# Altium project HW_ADHERENT_SYSCTRL_R1.PrjPcb (part 2 of 2)

## Sheet 05_MCU.SchDoc: HW_ADHERENT_SYSCTRL_R1
size A3; Organization: ASISGUARD; Address1: Kemalpasa, Kemalpasa Cd. No:290 D:292H, 35060 Bornova/Izmir/Turkey; SheetNumber: 8; SheetTotal: 14
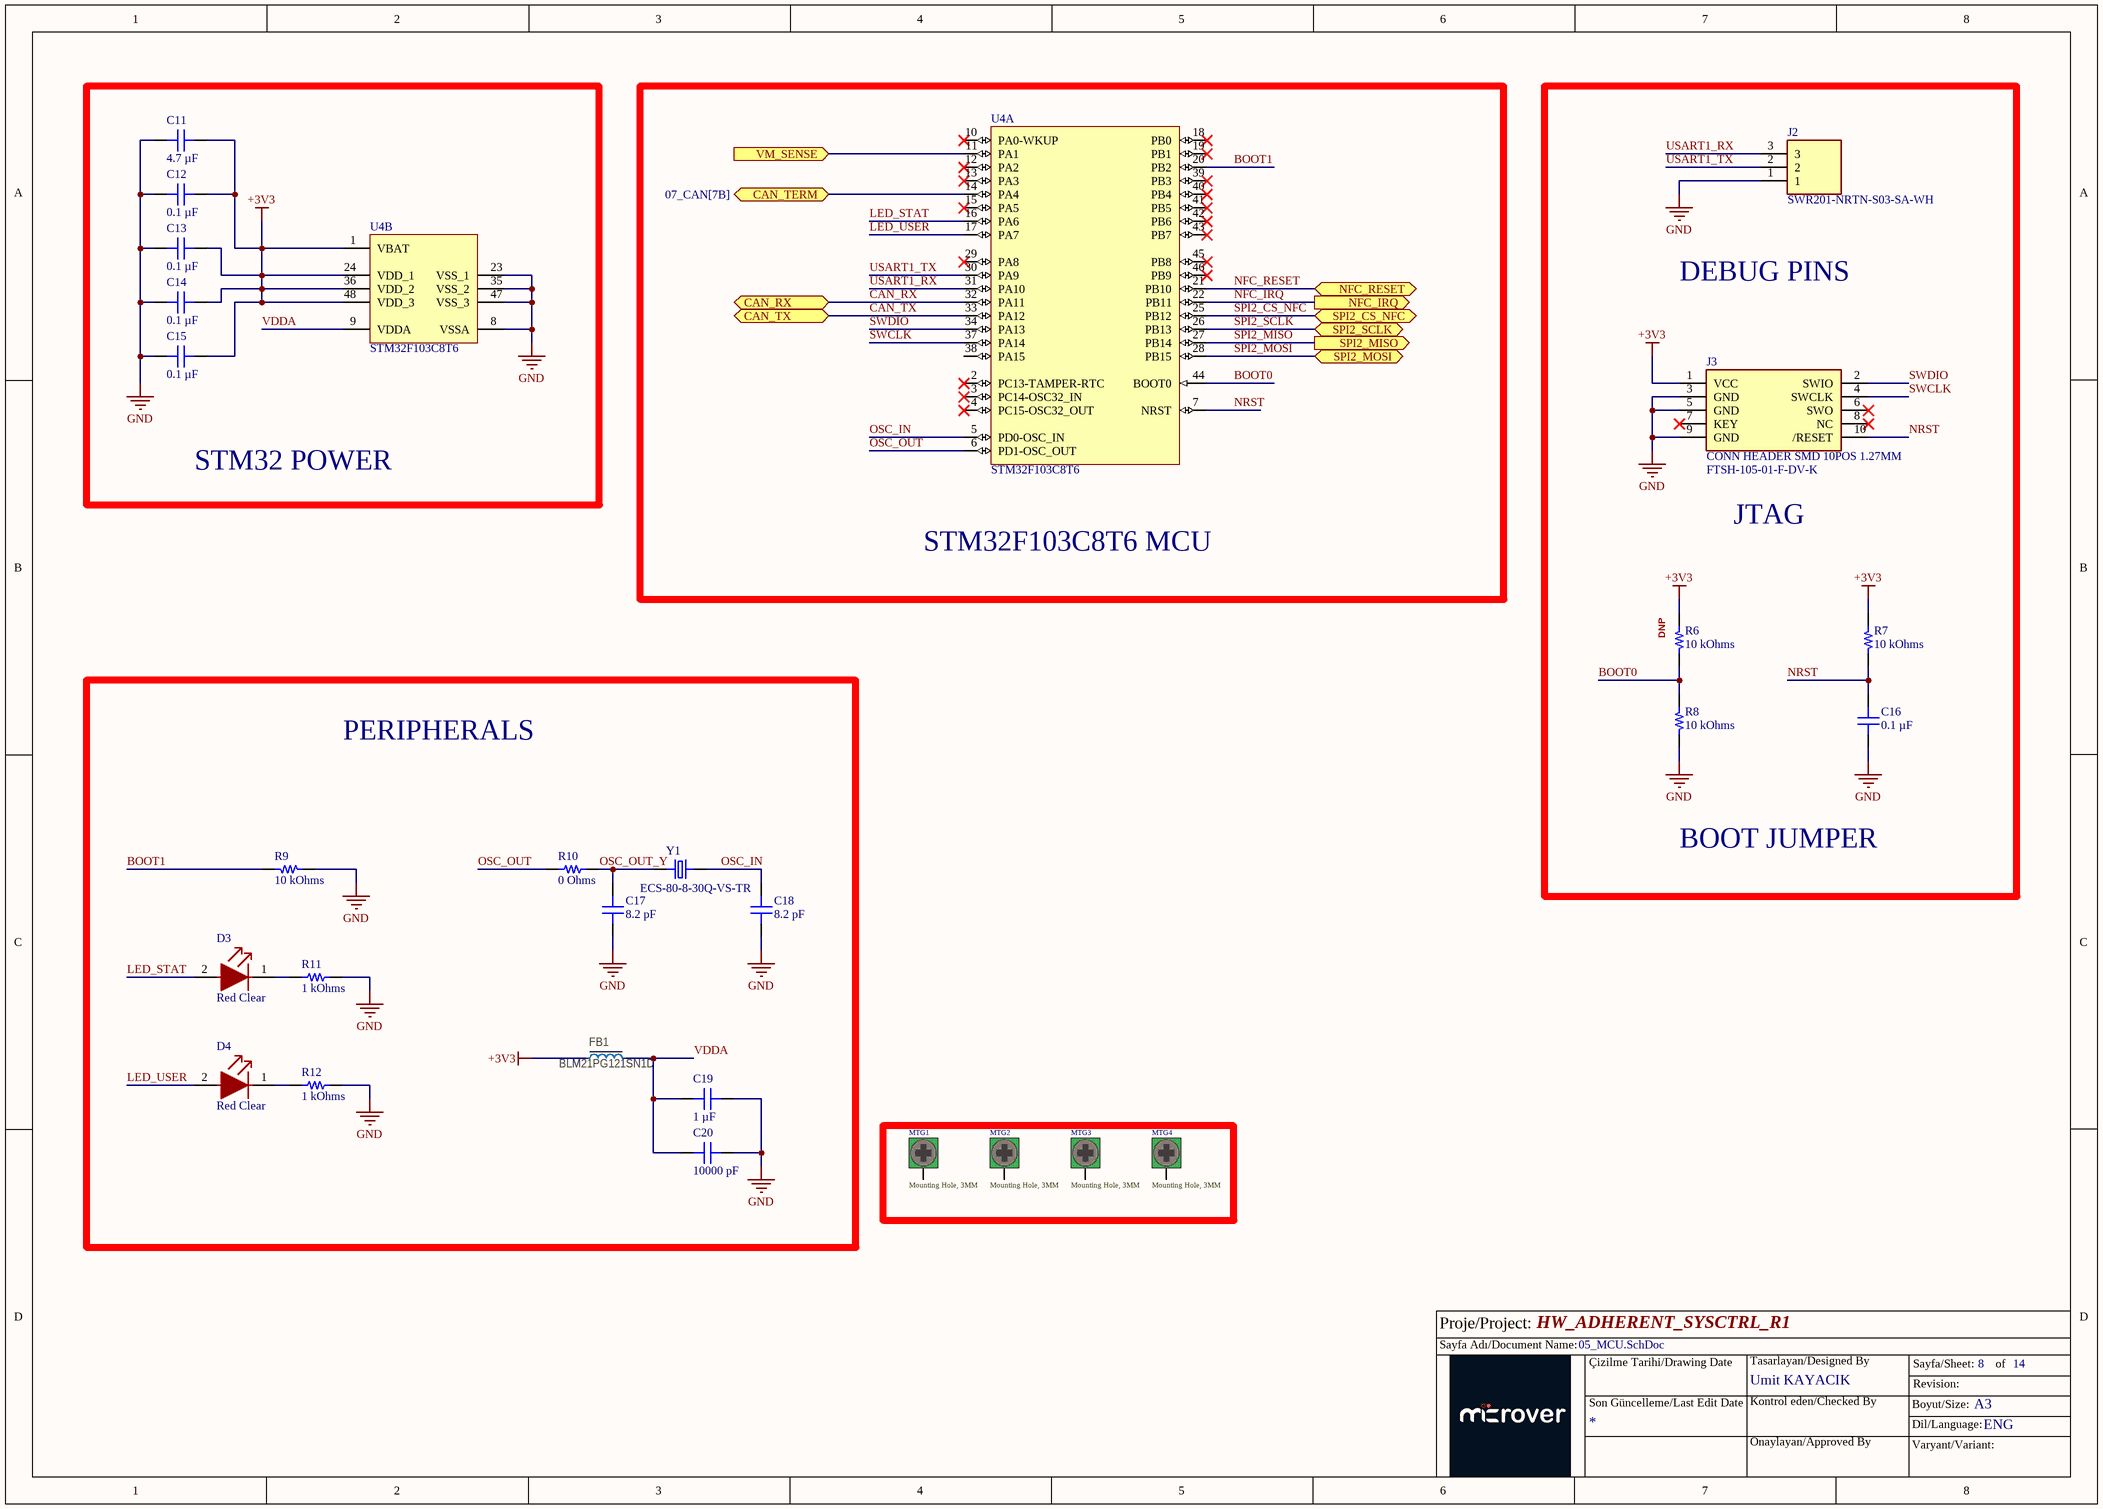
[diagram p5: 05_MCU.SchDoc]

### Parts
C11  4.7 µF  [CAP 0805_2012]
C12  Capacitance: 0.1 µF  [CAP 0603_1608]  (hidden comment: GCM188R71H104KA57J)
C13  Capacitance: 0.1 µF  [CAP 0603_1608]  (hidden comment: GCM188R71H104KA57J)
C14  Capacitance: 0.1 µF  [CAP 0603_1608]  (hidden comment: GCM188R71H104KA57J)
C15  Capacitance: 0.1 µF  [CAP 0603_1608]  (hidden comment: GCM188R71H104KA57J)
C16  Capacitance: 0.1 µF  [CAP 0603_1608]  (hidden comment: GCM188R71H104KA57J)
C17  8.2 pF  [CAP 0402_1005]
C18  8.2 pF  [CAP 0402_1005]
C19  1 µF  [CAP 0603_1608]
C20  10000 pF  [CAP 0603_1608]
D3  Color: Red Clear  [Lite-On_RED_0603]  (hidden comment: LED RED CLEAR SMD)
D4  Color: Red Clear  [Lite-On_RED_0603]  (hidden comment: LED RED CLEAR SMD)
FB1  BLM21PG121SN1D  [INDC2012X11L]
J2  SWR201-NRTN-S03-SA-WH  [SHDR3W50P0X200_1X3_790X460X630P]
J3  CONN HEADER SMD 10POS 1.27MM  [Samtec_0_MFG]
MTG1  Mounting Hole, 3MM  [MTG-PTH-3MM]  (no BOM)
MTG2  Mounting Hole, 3MM  [MTG-PTH-3MM]  (no BOM)
MTG3  Mounting Hole, 3MM  [MTG-PTH-3MM]  (no BOM)
MTG4  Mounting Hole, 3MM  [MTG-PTH-3MM]  (no BOM)
R6  10 kOhms  [RES 0402_1005]
R7  10 kOhms  [RES 0402_1005]
R8  10 kOhms  [RES 0402_1005]
R9  10 kOhms  [RES 0402_1005]
R10  0 Ohms  [RES 0402_1005]
R11  1 kOhms  [RES 0402_1005]
R12  1 kOhms  [RES 0402_1005]
U4  STM32F103C8T6  [LQFP48_STM]  (parts A,B of 2)
Y1  ECS-80-8-30Q-VS-TR  [XTAL_ECS-80-8-30Q-VS-TR]

### Blocks framed on the sheet
STM32 POWER: C11-C15 U4
STM32F103C8T6 MCU: U4
PERIPHERALS: C17-C20 D3 D4 FB1 R9-R12 Y1

### Ports
CAN_RX (bidir, see 07_CAN[2B]), CAN_TERM (bidir, see 07_CAN[7B]), CAN_TX (bidir, see 07_CAN[2B]), NFC_IRQ (out), NFC_RESET (bidir), SPI2_CS_NFC (bidir), SPI2_MISO (out), SPI2_MOSI (bidir), SPI2_SCLK (bidir), VM_SENSE (in)

### Nets
+3V3: C11.2 C12.1 C13.1 C14.1 C15.1 FB1.1 J3.1(VCC) R6.1 R7.1 U4.1(VBAT) U4.24(VDD_1) U4.36(VDD_2) U4.48(VDD_3)
GND: C11.1 C12.2 C13.2 C14.2 C15.2 C16.2 C17.1 C18.1 C19.2 C20.2 J2.1 J3.3(GND) J3.5(GND) J3.9(GND) R8.2 R9.1 R11.2 R12.2 U4.8(VSSA) U4.23(VSS_1) U4.35(VSS_2) U4.47(VSS_3)
BOOT0: R6.2 R8.1 U4.44(BOOT0)
BOOT1: R9.2 U4.20(PB2)
CAN_RX: U4.32(PA11) ; port CAN_RX
CAN_TX: U4.33(PA12) ; port CAN_TX
LED_STAT: D3.2(A) U4.16(PA6)
LED_USER: D4.2(A) U4.17(PA7)
NFC_IRQ: U4.22(PB11) ; port NFC_IRQ
NFC_RESET: U4.21(PB10) ; port NFC_RESET
NRST: C16.1 J3.10(/RESET) R7.2 U4.7(NRST)
OSC_IN: C18.2 U4.5(PD0-OSC_IN) Y1.2(OUT/IN)
OSC_OUT: R10.1 U4.6(PD1-OSC_OUT)
OSC_OUT_Y: C17.2 R10.2 Y1.1(IN/OUT)
SPI2_CS_NFC: U4.25(PB12) ; port SPI2_CS_NFC
SPI2_MISO: U4.27(PB14) ; port SPI2_MISO
SPI2_MOSI: U4.28(PB15) ; port SPI2_MOSI
SPI2_SCLK: U4.26(PB13) ; port SPI2_SCLK
SWCLK: J3.4(SWCLK) U4.37(PA14)
SWDIO: J3.2(SWIO) U4.34(PA13)
USART1_RX: J2.3 U4.31(PA10)
USART1_TX: J2.2 U4.30(PA9)
VDDA: C19.1 C20.1 FB1.2 U4.9(VDDA)
NetD3_1: D3.1(C) R11.1
NetD4_1: D4.1(C) R12.1
NetU4_11: U4.11(PA1) ; port VM_SENSE
NetU4_14: U4.14(PA4) ; port CAN_TERM

Not connected (* = marked no-connect by the designer): J3 6(SWO)* 7(KEY)* 8(NC)*; MTG1 0; MTG2 0; MTG3 0; MTG4 0; U4 2(PC13-TAMPER-RTC)* 3(PC14-OSC32_IN)* 4(PC15-OSC32_OUT)* 10(PA0-WKUP)* 12(PA2)* 13(PA3)* 15(PA5)* 18(PB0)* 19(PB1)* 29(PA8)* 38(PA15) 39(PB3)* 40(PB4)* 41(PB5)* 42(PB6)* 43(PB7)* 45(PB8)* 46(PB9)*

### Notes on the sheet
- DEBUG PINS
- JTAG
- (near R6) DNP
- BOOT JUMPER
- Proje/Project:
- Sayfa Adı/Document Name:
- Çizilme Tarihi/Drawing Date
- Umit KAYACIK
- Tasarlayan/Designed By
- Sayfa/Sheet:
- Revision:
- of
- Son Güncelleme/Last Edit Date
- Kontrol eden/Checked By
- Onaylayan/Approved By
- Boyut/Size:
- Varyant/Variant:
- Dil/Language:
- A3
- ENG

### Library data of the parts
C11 = GRM21BZ71H475KE15K: CAP CER 4.7UF 50V X7R 0805; manufacturer: Murata Electronics; Tolerance: ±10%; Part Number: GRM21BZ71H475KE15K; Capacitance: 4.7 µF; Applications: General Purpose; componentlink1description: Datasheet; componentlink1url: https://search.murata.co.jp/Ceramy/image/img/A01X/G101/ENG/GRM21BZ71H475KE15-01.pdf; componentlink2description: DigiKey Link; componentlink2url: https://www.digikey.com/en/products/detail/murata-electronics/GRM21BZ71H475KE15K/13904908; Device Package: 0805 (2012 Metric); lastupdated: 6.04.2026 19:31:51; Lifecycle Status: Active; Minimum Order: 1; Mounting Type: Surface Mount, MLCC; Operating Temperature: -55°C ~ 125°C; Package / Case: 0805 (2012 Metric); packaging: TapeAndReel; partid: 39591; Part Status: Active; price: 0.17; series: GRM; Size / Dimension: 0.079" L x 0.049" W (2.00mm x 1.25mm); Supplier 1: DigiKey; Supplier Part Number 1: 490-GRM21BZ71H475KE15KCT-ND; Temperature Coefficient: X7R; Thickness (Max): 0.057" (1.45mm); value: 4.7 µF; Voltage - Rated: 50V
C12-C16 = GCM188R71H104KA57J: CAP CER 0.1UF 50V X7R 0603; manufacturer: Murata Electronics; Tolerance: ±10%; Part Number: GCM188R71H104KA57J; Applications: Automotive; componentlink1description: Datasheet; componentlink1url: https://psearch.en.murata.com/capacitor/product/GCM188R71H104KA57%23.pdf; componentlink2description: DigiKey Link; componentlink2url: https://www.digikey.com/en/products/detail/murata-electronics/GCM188R71H104KA57J/2591942; Device Package: 0603 (1608 Metric); lastupdated: 6.04.2026 19:22:36; Lifecycle Status: Active; Minimum Order: 1; Mounting Type: Surface Mount, MLCC; Operating Temperature: -55°C ~ 125°C; Package / Case: 0603 (1608 Metric); packaging: TapeAndReel; partid: 60442; Part Status: Not For New Designs; price: 0.03; Ratings: AEC-Q200; series: GCM; Size / Dimension: 0.063" L x 0.031" W (1.60mm x 0.80mm); Supplier 1: DigiKey; Supplier Part Number 1: 490-8020-1-ND; Temperature Coefficient: X7R; Thickness (Max): 0.035" (0.90mm); Voltage - Rated: 50V
C17 C18 = GMC04CG8R2J25NT: CAP0402 COG 8.2PF 5% 25V; manufacturer: Cal-Chip Electronics, Inc.; Temperature Coefficient: C0G, NP0; Part Number: GMC04CG8R2J25NT; Capacitance: 8.2 pF; Applications: General Purpose; componentlink1description: Datasheet; componentlink1url: https://calchip.com/wp-content/uploads/2025/05/GMC-Series-3.pdf; componentlink2description: DigiKey Link; componentlink2url: https://www.digikey.com/en/products/detail/cal-chip-electronics-inc/GMC04CG8R2J25NT/27784357; Device Package: 0402 (1005 Metric); Features: General Purpose; lastupdated: 6.04.2026 19:06:51; Lifecycle Status: Active; Minimum Order: 1; Mounting Type: Surface Mount, MLCC; Operating Temperature: -55°C ~ 125°C; Package / Case: 0402 (1005 Metric); packaging: TapeAndReel; partid: 61382; price: 0.07; series: GMC; Size / Dimension: 0.039" L x 0.020" W (1.00mm x 0.50mm); Supplier 1: DigiKey; Supplier Part Number 1: 4713-GMC04CG8R2J25NTCT-ND; Thickness (Max): 0.022" (0.55mm); Tolerance: ±5%; value: 8.2 pF; Voltage - Rated: 25V
C19 = GMC10X7R105K25NT: CAP0603 X7R 1UF 10% 25V; manufacturer: Cal-Chip Electronics, Inc.; Part Number: GMC10X7R105K25NT; Capacitance: 1 µF; Applications: General Purpose; componentlink1description: Datasheet; componentlink1url: https://calchip.com/wp-content/uploads/2023/05/gmc_series.pdf; componentlink2description: DigiKey Link; componentlink2url: https://www.digikey.com/en/products/detail/cal-chip-electronics-inc/GMC10X7R105K25NT/22461338; Device Package: 0603 (1608 Metric); lastupdated: 6.04.2026 19:18:33; Lifecycle Status: Active; Minimum Order: 1; Mounting Type: Surface Mount, MLCC; Operating Temperature: -55°C ~ 125°C; Package / Case: 0603 (1608 Metric); packaging: TapeAndReel; partid: 68086; price: 0.01; series: GMC; Size / Dimension: 0.063" L x 0.031" W (1.60mm x 0.80mm); Supplier 1: DigiKey; Supplier Part Number 1: 4713-GMC10X7R105K25NTCT-ND; Temperature Coefficient: X7R; Thickness (Max): 0.037" (0.95mm); Tolerance: ±10%; value: 1 µF; Voltage - Rated: 25V
C20 = C0603C103K4RECTU: CAP CER 0603 10NF 16V X7R 10%; manufacturer: KEMET; Part Number: C0603C103K4RECTU; Capacitance: 10000 pF; Applications: ESD Protection; componentlink1description: Datasheet; componentlink1url: https://search.kemet.com/download/datasheet/C0603C103K4REC7867; componentlink2description: DigiKey Link; componentlink2url: https://www.digikey.com/en/products/detail/kemet/C0603C103K4RECTU/8643658; Device Package: 0603 (1608 Metric); lastupdated: 6.04.2026 19:17:55; Lifecycle Status: Active; Minimum Order: 1; Mounting Type: Surface Mount, MLCC; Operating Temperature: -55°C ~ 125°C; Package / Case: 0603 (1608 Metric); packaging: TapeAndReel; partid: 66152; price: 0.01; series: ESD SMD Comm X7R; Size / Dimension: 0.063" L x 0.031" W (1.60mm x 0.80mm); Supplier 1: DigiKey; Supplier Part Number 1: 399-C0603C103K4RECTUCT-ND; Temperature Coefficient: X7R; Thickness (Max): 0.034" (0.87mm); Tolerance: ±10%; value: 10000 pF; Voltage - Rated: 16V
D3 D4 = LTST-C191KRKT_2: Red 631nm LED Indication - Discrete 2V 0603 (1608 Metric); Manufacturer: Lite-On Inc.; Order Code: DIGI: 160-1447-2-ND; Manufacturer Part Number: LTST-C191KRKT
FB1 = FB0402-120R@100M-500mA: Ferrite Bead, 120 Ohm @ 100MHz, 500mA, 250 mOhm Max; Manufacturer: Murata; Manufacturer Part Number: BLM15AG121SN1D; Part number IPS: 00000009954; Part number Norautron: 265230631; Part number NEMS: 100300099; Value: 120R/0.55A; Note: Chip EMIFIL Inductor Type Chip Ferrite Bead; Artikkelnr Noca: 33029317; Pad Count: 2; Component Status: Active; Part Number: FB0402-120R@100M-500mA; Footprint Doc: 0402; LatestRevisionDate: 2014-01-10; Published: 2011-11-14; ComponentLink1Description: Datasheet; ComponentLink2Description: Supplier link; ComponentLink1URL: N.A.; ComponentLink2URL: N.A.; HelpURL: http://search.murata.co.jp/Ceramy/image/img/PDF/ENG/L0110S0100BLM15A_SN.pdf; Supplier 1: Digi-Key; Supplier Part Number 1: 490-1005-1-ND; Supplier 2: Farnell; Supplier Part Number 2: 151-5760; Component Class: Inductors; PartId: 100300099; Author: rsk
J2 = SWR201-NRTN-S03-SA-WH: Connector; Manufacturer_Name: Sullins; Datasheet Link: https://drawings-pdf.s3.amazonaws.com/11623.pdf; Height: 6.3mm; Manufacturer_Part_Number: SWR201-NRTN-S03-SA-WH
J3 = FTSH-105-01-F-DV-K: Connector Header Surface Mount 10 position 0.050" (1.27mm); Order Code: DIGI: SAM8796-ND; Manufacturer Part Number: FTSH-105-01-F-DV-K
MTG1-MTG4 = MTG3MM
R6-R9 = RMCF0402FT10K0: RES 10K OHM 1% 1/16W 0402; Manufacturer: Stackpole Electronics Inc; Power (Watts): 0.063W, 1/16W; Temperature Coefficient: ±100ppm/°C; Part Number: RMCF0402FT10K0; Value: 10 kOhms; ComponentLink1Description: Datasheet; ComponentLink1URL: https://www.seielect.com/catalog/sei-rmcf_rmcp.pdf; ComponentLink2Description: DigiKey Link; ComponentLink2URL: https://www.digikey.com/en/products/detail/stackpole-electronics-inc/RMCF0402FT10K0/1761433; Composition: Thick Film; Device Package: 0402 (1005 Metric); Features: Automotive AEC-Q200; Height - Seated (Max): 0.016" (0.40mm); LastUpdated: 9.02.2024 20:29:20; Lifecycle Status: Active; Minimum Order: 1; Number of Terminations: 2; Operating Temperature: -55°C ~ 155°C; Package / Case: 0402 (1005 Metric); Packaging: CutTape; PartId: 20541; Part Status: Active; Price: 0.01; Ratings: AEC-Q200; Resistance: 10 kOhms; Series: RMCF; Size / Dimension: 0.039" L x 0.020" W (1.00mm x 0.50mm); Supplier 1: DigiKey; Supplier Part Number 1: RMCF0402FT10K0CT-ND; Supplier Device Package: 0402; Tolerance: ±1%
R10 = RMCF0402ZT0R00: RES 0 OHM JUMPER 1/16W 0402; Manufacturer: Stackpole Electronics Inc; Power (Watts): 0.063W, 1/16W; Part Number: RMCF0402ZT0R00; Value: 0 Ohms; ComponentLink1Description: Datasheet; ComponentLink1URL: https://www.seielect.com/catalog/sei-rmcf_rmcp.pdf; ComponentLink2Description: DigiKey Link; ComponentLink2URL: https://www.digikey.com/en/products/detail/stackpole-electronics-inc/RMCF0402ZT0R00/1756905; Composition: Thick Film; Device Package: 0402 (1005 Metric); Features: Automotive AEC-Q200; Height - Seated (Max): 0.016" (0.40mm); LastUpdated: 9.02.2024 20:29:34; Lifecycle Status: Active; Minimum Order: 1; Number of Terminations: 2; Operating Temperature: -55°C ~ 155°C; Package / Case: 0402 (1005 Metric); Packaging: CutTape; PartId: 17627; Part Status: Active; Price: 0.01; Ratings: AEC-Q200; Resistance: 0 Ohms; Series: RMCF; Size / Dimension: 0.039" L x 0.020" W (1.00mm x 0.50mm); Supplier 1: DigiKey; Supplier Part Number 1: RMCF0402ZT0R00CT-ND; Supplier Device Package: 0402; Tolerance: Jumper
R11 R12 = RMCF0402FT1K00: RES 1K OHM 1% 1/16W 0402; Manufacturer: Stackpole Electronics Inc; Power (Watts): 0.063W, 1/16W; Temperature Coefficient: ±100ppm/°C; Part Number: RMCF0402FT1K00; Value: 1 kOhms; ComponentLink1Description: Datasheet; ComponentLink1URL: https://www.seielect.com/catalog/sei-rmcf_rmcp.pdf; ComponentLink2Description: DigiKey Link; ComponentLink2URL: https://www.digikey.com/en/products/detail/stackpole-electronics-inc/RMCF0402FT1K00/1761754; Composition: Thick Film; Device Package: 0402 (1005 Metric); Features: Automotive AEC-Q200; Height - Seated (Max): 0.016" (0.40mm); LastUpdated: 9.02.2024 20:29:20; Lifecycle Status: Active; Minimum Order: 1; Number of Terminations: 2; Operating Temperature: -55°C ~ 155°C; Package / Case: 0402 (1005 Metric); Packaging: CutTape; PartId: 20544; Part Status: Active; Price: 0.01; Ratings: AEC-Q200; Resistance: 1 kOhms; Series: RMCF; Size / Dimension: 0.039" L x 0.020" W (1.00mm x 0.50mm); Supplier 1: DigiKey; Supplier Part Number 1: RMCF0402FT1K00CT-ND; Supplier Device Package: 0402; Tolerance: ±1%
U4 = STM32F103C8T6: ARM Cortex-M3 32-bit MCU, 64 KB Flash, 20 KB Internal RAM, 37 I/Os, 48-pin LQFP, -40 to 85 degC, Tray; Operating Frequency(F) (Processor speed) (MHz): 72; Supply Voltage(Vcc) min (V): 2; FLASH Size (Prog) (kB): 64; Internal RAM Size (kB): 20; I/Os (High Current): 37; A/D Converter: 2x12-bit (10 Channel); Core: ARM Cortex-M3; ComponentLink2Description: Datasheet; ComponentLink3Description: Package Specification; Mounting Technology: Surface Mount; ComponentLink3URL: http://www.st.com/st-web-ui/static/active/en/resource/technical/document/datasheet/DM00058181.pdf; DatasheetVersion: Rev. 16; ComponentLink1URL: http://www.st.com/web/en/home.html; ComponentLink1Description: Manufacturer URL; Manufacturer Part Number: STM32F103C8T6; Packing: Tray; PackageVersion: Rev. 6, 06/2013; PackageReference: LQFP48; PackageDescription: 48-Pin Low Profile Quad Flat Package, 7 x 7 mm Body, 0.5 mm Pitch; ComponentLink2URL: http://www.st.com/st-web-ui/static/active/en/resource/technical/document/datasheet/CD00161566.pdf; LCSC Part Number: C8734; LCSC Manufacturer Part Number: STM32F103C8T6
Y1 = ECS-80-8-30Q-VS-TR: 8 MHz Â±30ppm Crystal 8pF 100 Ohms 2-SMD, No Lead; MF: ECS Inc.; SnapEDA_Link: https://www.snapeda.com/parts/ECS-80-8-30Q-VS-TR/ECS/view-part/?ref=snap; Package: SMD-2 ECS Inc.; Value: *; MP: ECS-80-8-30Q-VS-TR; Check_prices: https://www.snapeda.com/parts/ECS-80-8-30Q-VS-TR/ECS/view-part/?ref=eda

## Sheet 06_DRIVER.SchDoc: HW_ADHERENT_SYSCTRL_R1
size A3; Organization: ASISGUARD; Address1: Kemalpasa, Kemalpasa Cd. No:290 D:292H, 35060 Bornova/Izmir/Turkey; SheetNumber: 9; SheetTotal: 14
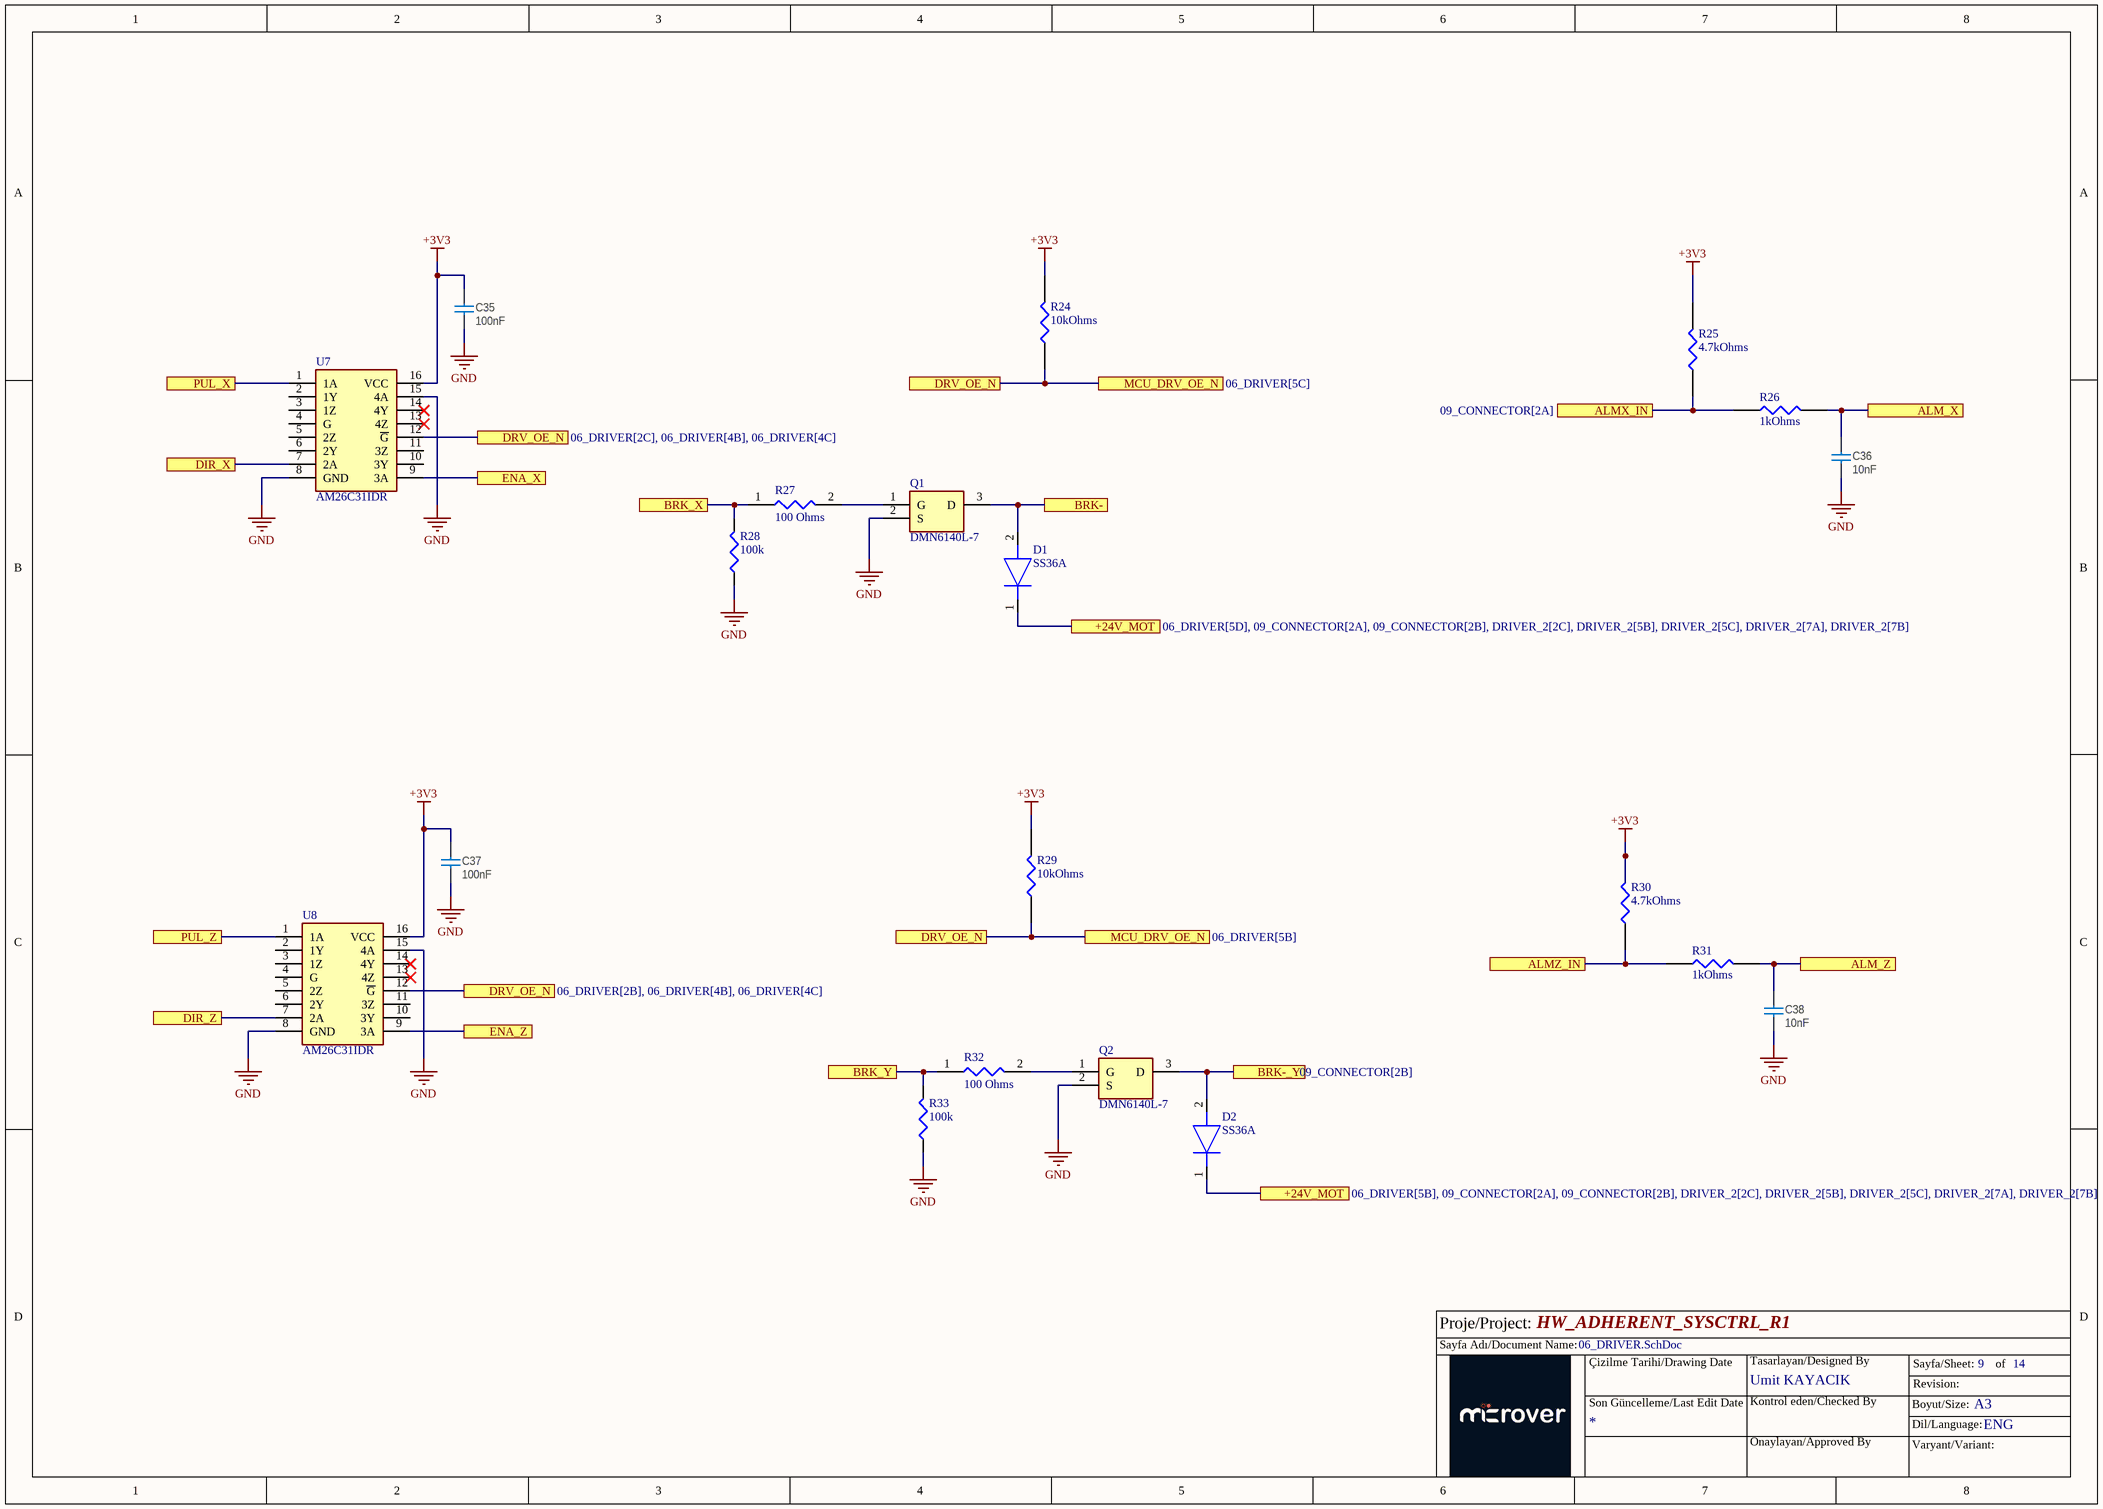
[diagram p6: 06_DRIVER.SchDoc]

### Parts
C35  100nF  [CAPC0603X03L_C]
C36  10nF  [CAPC0603X03L_C]
C37  100nF  [CAPC0603X03L_C]
C38  10nF  [CAPC0603X03L_C]
D1  SS36A  [DIOM5026X262N]
D2  SS36A  [DIOM5026X262N]
Q1  DMN6140L-7  [SOT96P240X110-3N]
Q2  DMN6140L-7  [SOT96P240X110-3N]
R24  10kOhms  [RESC0603X03L_C]
R25  4.7kOhms  [RES_0402]
R26  1kOhms  [RESC0603X03L_C]
R27  100 Ohms  [RESC1608X55N]
R28  value 100k  [SMR0603]  (hidden comment: RES 180K OHM 1% 1/10W 0603)
R29  10kOhms  [RESC0603X03L_C]
R30  4.7kOhms  [RES_0402]
R31  1kOhms  [RESC0603X03L_C]
R32  100 Ohms  [RESC1608X55N]
R33  value 100k  [SMR0603]  (hidden comment: RES 180K OHM 1% 1/10W 0603)
U7  AM26C31IDR  [SOIC127P600X175-16N]
U8  AM26C31IDR  [SOIC127P600X175-16N]

### Ports
+24V_MOT (see 06_DRIVER[5B], 09_CONNECTOR[2A], 09_CONNECTOR[2B], DRIVER_2[2C], DRIVER_2[5B], DRIVER_2[5C], DRIVER_2[7A], DRIVER_2[7B]), +24V_MOT (see 06_DRIVER[5D], 09_CONNECTOR[2A], 09_CONNECTOR[2B], DRIVER_2[2C], DRIVER_2[5B], DRIVER_2[5C], DRIVER_2[7A], DRIVER_2[7B]), ALM_X, ALM_Z, ALMX_IN (see 09_CONNECTOR[2A]), ALMZ_IN, BRK-, BRK-_Y (see 09_CONNECTOR[2B]), BRK_X, BRK_Y, DIR_X, DIR_Z, DRV_OE_N (see 06_DRIVER[2B], 06_DRIVER[2C], 06_DRIVER[4B]), DRV_OE_N (see 06_DRIVER[2B], 06_DRIVER[2C], 06_DRIVER[4C]), DRV_OE_N (see 06_DRIVER[2B], 06_DRIVER[4B], 06_DRIVER[4C]), DRV_OE_N (see 06_DRIVER[2C], 06_DRIVER[4B], 06_DRIVER[4C]), ENA_X, ENA_Z, MCU_DRV_OE_N (see 06_DRIVER[5B]), MCU_DRV_OE_N (see 06_DRIVER[5C]), PUL_X, PUL_Z

### Nets
+3V3: C35.2 C37.2 R24.2 R25.2 R29.2 R30.2 U7.16(VCC) U8.16(VCC)
GND: C35.1 C36.1 C37.1 C38.1 Q1.2(S) Q2.2(S) R28.1 R33.1 U7.8(GND) U7.15(4A) U8.8(GND) U8.15(4A)
NetC36_2: C36.2 R26.2 ; port ALM_X
NetC38_2: C38.2 R31.2 ; port ALM_Z
NetC61_2: D1.1(K) D2.1(K) ; port +24V_MOT
NetD1_2: D1.2(A) Q1.3(D) ; port BRK-
NetD2_2: D2.2(A) Q2.3(D) ; port BRK-_Y
NetJ11_7: R25.1 R26.1 ; port ALMX_IN
NetQ1_1: Q1.1(G) R27.2
NetQ2_1: Q2.1(G) R32.2
NetR24_1: R24.1 R29.1 U7.12(~{G}) U8.12(~{G}) ; port DRV_OE_N, port MCU_DRV_OE_N
NetR27_1: R27.1 R28.2 ; port BRK_X
NetR30_1: R30.1 R31.1 ; port ALMZ_IN
NetR32_1: R32.1 R33.2 ; port BRK_Y
NetU7_1: U7.1(1A) ; port PUL_X
NetU7_7: U7.7(2A) ; port DIR_X
NetU7_9: U7.9(3A) ; port ENA_X
NetU8_1: U8.1(1A) ; port PUL_Z
NetU8_7: U8.7(2A) ; port DIR_Z
NetU8_9: U8.9(3A) ; port ENA_Z

Not connected (* = marked no-connect by the designer): U7 2(1Y) 3(1Z) 4(G) 5(2Z) 6(2Y) 10(3Y) 11(3Z) 13(4Z)* 14(4Y)*; U8 2(1Y) 3(1Z) 4(G) 5(2Z) 6(2Y) 10(3Y) 11(3Z) 13(4Z)* 14(4Y)*

### Notes on the sheet
- Proje/Project:
- Sayfa Adı/Document Name:
- Çizilme Tarihi/Drawing Date
- Umit KAYACIK
- Tasarlayan/Designed By
- Sayfa/Sheet:
- Revision:
- of
- Son Güncelleme/Last Edit Date
- Kontrol eden/Checked By
- Onaylayan/Approved By
- Boyut/Size:
- Varyant/Variant:
- Dil/Language:
- A3
- ENG

### Library data of the parts
C35 C37 = C0201-100n: Capacitor, X5R, ±10%; Manufacturer: N.A.; Part number IPS: 00000001248, 00000002505; Part number Norautron: 262071862; Part number NEMS: 100200078; Note: 16V; Pad Count: 2; Component Status: Active; Part Number: C0201-100n; Manufacturer Part Number: N.A.; ComponentLink1URL: N.A.; ComponentLink1Description: Datasheet; ComponentLink2URL: N.A.; ComponentLink2Description: Supplier link; HelpURL: N.A.; Footprint Doc: 0201; LatestRevisionDate: 2017-11-09; Published: 2014-11-13; Value: 100nF; Supplier 1: N.A.; Supplier Part Number 1: N.A.; Supplier 2: N.A.; Supplier Part Number 2: N.A.; Artikkelnr Noca: N.A.; PartId: 100200078; Component Class: Capacitors; Author: rsk
C36 C38 = C0201-10n: Capacitor, X7R, ±10%; Manufacturer: N.A.; Part number IPS: 00000003480; Part number Norautron: 26621779; Part number NEMS: 100200067; Note: 10V; Pad Count: 2; Component Status: Active; Part Number: C0201-10n; Manufacturer Part Number: N.A.; Footprint Doc: 0201; LatestRevisionDate: 2017-11-09; Published: 2014-11-13; Value: 10nF; Artikkelnr Noca: N.A.; ComponentLink1URL: N.A.; ComponentLink1Description: Datasheet; ComponentLink2URL: N.A.; ComponentLink2Description: Supplier link; HelpURL: N.A.; Supplier 1: N.A.; Supplier Part Number 1: N.A.; Supplier 2: N.A.; Supplier Part Number 2: N.A.; Author: rsk; Component Class: Capacitors; PartId: 100200067
D1 D2 = SS36A: Diode; Manufacturer_Name: HY Electronic; Height: 2.62mm; Manufacturer_Part_Number: SS36A
Q1 Q2 = DMN6140L-7: Transistor; Manufacturer_Name: Diodes Incorporated; Datasheet Link: https://www.diodes.com//assets/Datasheets/DMN6140L.pdf; Height: 1.1mm; Manufacturer_Part_Number: DMN6140L-7; Mouser Part Number: 621-DMN6140L-7; Mouser Price/Stock: https://www.mouser.co.uk/ProductDetail/Diodes-Incorporated/DMN6140L-7?qs=M%2FOdCRO8QQ0gki98nN7lXQ%3D%3D; Arrow Part Number: DMN6140L-7; Arrow Price/Stock: https://www.arrow.com/en/products/dmn6140l-7/diodes-incorporated?utm_currency=USD&region=asia
R24 R29 = TNPW060310K0FHTA: 10 kOhms ±1% 0.1W, 1/10W Chip Resistor 0603 (1608 Metric) Automotive AEC-Q200 Thin Film; Manufacturer: Vishay Dale; Supplier: Digi; 541-3906-6-ND
R25 R30 = RT0402FRE074K7L: RES SMD 4.7K OHM 1% 1/16W 0402; Manufacturer: Yageo Group; Max Power Dissipation: 63mW; Power Rating: 62.5mW; Temperature Coefficient: 50ppm/°C; Voltage Rating: 50V; Case Code (Imperial): 0402; Case/Package: 0402; Category: Chip SMD Resistors; China RoHS: Non-Compliant; Composition: Thin Film; Contact Plating: Lead, Tin; Country of Origin: Mainland China; Export Control Classification Number (ECCN) Code: EAR99; Features: Moisture Resistant; Harmonized Tariff Schedule (HTS) Code: 8533.21.00.30; Height: 300µm; Introduction Date: 2008-06-09; Lead Free: Lead Free; Length: 1mm; Lifecycle Status: Production; Manufacturer Part Number: RT0402FRE074K7L; Max Operating Temperature: 155°C; Min Operating Temperature: -55°C; Mounting Technology: Surface Mount; Number of Terminals: 2; Number of Terminations: 2; Radiation Hardening: No; REACH SVHC: Yes; RoHS: Compliant; Schedule B: 8533210045, 8533210045|8533210045, 8533210045|8533210045|8533210045, 8533210045|8533210045|8533210045|8533210045; Termination: SMD/SMT; Tolerance: 1%; Voltage Rating (DC): 50V; Width: 500µm; Working Voltage: 50V; Value: 4.7kOhms
R26 R31 = CPF0603B1K0E: RES SMD 1K OHM 0.1% 1/16W 0603; Manufacturer: TE Connectivity; Manufacturer Lifecycle Status: ACTIVE; Max Power Dissipation: 63mW; Number of Resistors: 1; Operating Supply Voltage: 50V; Temperature Coefficient: 25ppm/°C; Case Code (Metric): 1608; Case/Package: 0603; Category: Chip SMD Resistors; China RoHS: Compliant; Composition: Thin Film; Depth: 800µm; ELV: Compliant; Export Control Classification Number (ECCN) Code: EAR99; Harmonized Tariff Schedule (HTS) Code: 8533.21.00.30; Height: 450µm; Introduction Date: 2009-09-20; Length: 1.55mm; Lifecycle Status: Production; Manufacturer Part Number: CPF0603B1K0E; Max Operating Temperature: 155°C; Min Operating Temperature: -55°C; Mounting Technology: Surface Mount; Number of Terminals: 2; Number of Terminations: 2; Packaging: Tape and Reel; Power Rating: 63mW; Radiation Hardening: No; REACH SVHC: Yes; RoHS: Compliant; Schedule B: 8533210045|8533210045|8533210045|8533210045|8533210045; Termination: Solder; Tolerance: 0.1%; Voltage Rating: 50V; Voltage Rating (DC): 50V; Weight: 2.012816mg; Width: 800µm; Working Voltage: 50V; Value: 1kOhms
R27 R32 = RC0603JR07100RL: Resistor; Manufacturer_Name: Yageo Group; Datasheet Link: http://www.yageo.com/documents/recent/PYu-RC0603_51_RoHS_L_v5.pdf; Height: 0.55mm; Manufacturer_Part_Number: RC0603JR07100RL; Arrow Part Number: RC0603JR07100RL; Arrow Price/Stock: https://www.arrow.com/en/products/rc0603jr-07100rl/yageo
R28 R33 = RES0603_100K_%1: 100 kOhms ±1% 0.1W, 1/10W Chip Resistor 0603 (1608 Metric) Moisture Resistant Thick Film; Manufacturer Part Number: RC0603FR-07100KL; Order Code: DIGI : 311-100KHRTR-ND; LCSC Manufacturer Part Number: RC0603FR-07100KL; LCSC Part Number: C123419
U7 U8 = AM26C31IDR: 4/0 Driver 16-SOIC; Manufacturer: Texas Instruments; Supplier: Digi; 296-24344-6-ND

## Sheet DRIVER_2.SchDoc: HW_ADHERENT_SYSCTRL_R1
size A3; SheetNumber: 11; SheetTotal: 14
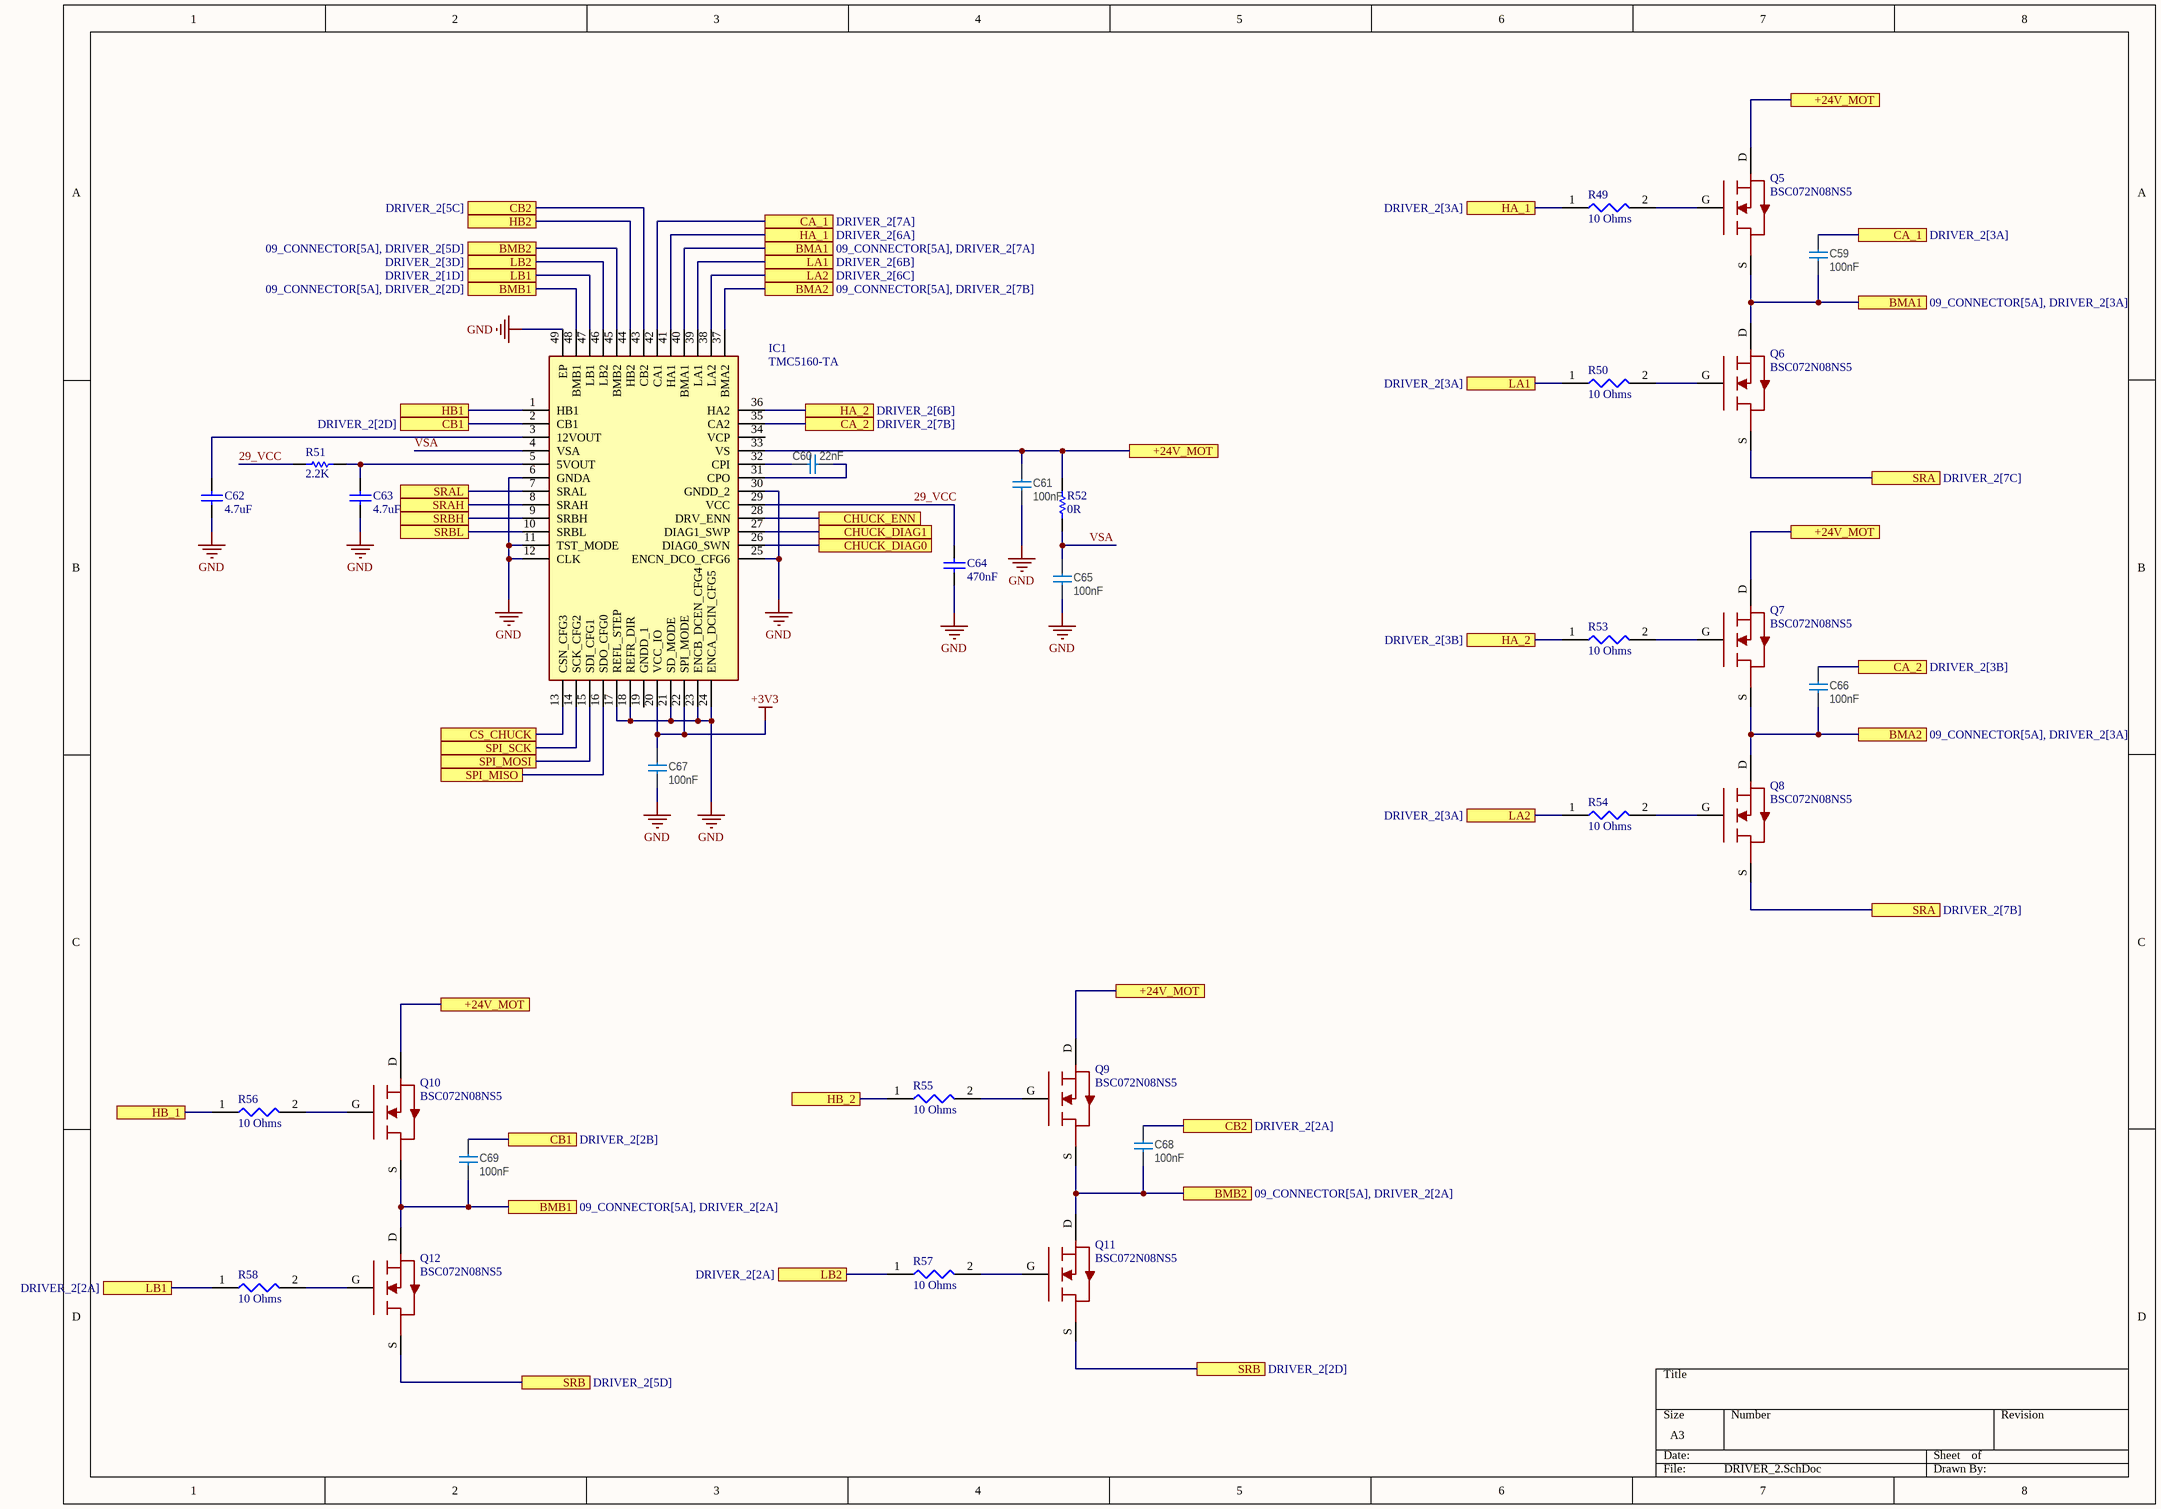
[diagram p7: DRIVER_2.SchDoc]

### Parts
C59  100nF  [CAPC0603X03L_C]
C60  22nF  [CAPC0603X03L_C]
C61  100nF  [CAPC0603X03L_C]
C62  value 4.7uF  [SMC0805]  (hidden comment: CAP CER 4.7UF 50V X5R 0805)
C63  value 4.7uF  [SMC0805]  (hidden comment: CAP CER 4.7UF 50V X5R 0805)
C64  value 470nF  [CAP0402(1005)x0.5]  (hidden comment: CAP CER 0.47UF 10V X5R 0402)
C65  100nF  [CAPC0603X03L_C]
C66  100nF  [CAPC0603X03L_C]
C67  100nF  [CAPC0603X03L_C]
C68  100nF  [CAPC0603X03L_C]
C69  100nF  [CAPC0603X03L_C]
IC1  TMC5160-TA  [QFP50P900X900X120-49N]
Q5  BSC072N08NS5  [BSC080N03LSG]
Q6  BSC072N08NS5  [BSC080N03LSG]
Q7  BSC072N08NS5  [BSC080N03LSG]
Q8  BSC072N08NS5  [BSC080N03LSG]
Q9  BSC072N08NS5  [BSC080N03LSG]
Q10  BSC072N08NS5  [BSC080N03LSG]
Q11  BSC072N08NS5  [BSC080N03LSG]
Q12  BSC072N08NS5  [BSC080N03LSG]
R49  10 Ohms  [RESC1608X55N]
R50  10 Ohms  [RESC1608X55N]
R51  2.2K  [0402_R]
R52  0R  [0402_R]
R53  10 Ohms  [RESC1608X55N]
R54  10 Ohms  [RESC1608X55N]
R55  10 Ohms  [RESC1608X55N]
R56  10 Ohms  [RESC1608X55N]
R57  10 Ohms  [RESC1608X55N]
R58  10 Ohms  [RESC1608X55N]

### Ports
+24V_MOT (see 06_DRIVER[5B], 06_DRIVER[5D], 09_CONNECTOR[2A], 09_CONNECTOR[2B], DRIVER_2[2C], DRIVER_2[5B], DRIVER_2[5C], DRIVER_2[7A]), +24V_MOT (see 06_DRIVER[5B], 06_DRIVER[5D], 09_CONNECTOR[2A], 09_CONNECTOR[2B], DRIVER_2[2C], DRIVER_2[5B], DRIVER_2[5C], DRIVER_2[7B]), +24V_MOT (see 06_DRIVER[5B], 06_DRIVER[5D], 09_CONNECTOR[2A], 09_CONNECTOR[2B], DRIVER_2[2C], DRIVER_2[5B], DRIVER_2[7A], DRIVER_2[7B]), +24V_MOT (see 06_DRIVER[5B], 06_DRIVER[5D], 09_CONNECTOR[2A], 09_CONNECTOR[2B], DRIVER_2[2C], DRIVER_2[5C], DRIVER_2[7A], DRIVER_2[7B]), +24V_MOT (see 06_DRIVER[5B], 06_DRIVER[5D], 09_CONNECTOR[2A], 09_CONNECTOR[2B], DRIVER_2[5B], DRIVER_2[5C], DRIVER_2[7A], DRIVER_2[7B]), BMA1 (see 09_CONNECTOR[5A], DRIVER_2[3A]), BMA1 (see 09_CONNECTOR[5A], DRIVER_2[7A]), BMA2 (see 09_CONNECTOR[5A], DRIVER_2[3A]), BMA2 (see 09_CONNECTOR[5A], DRIVER_2[7B]), BMB1 (see 09_CONNECTOR[5A], DRIVER_2[2A]), BMB1 (see 09_CONNECTOR[5A], DRIVER_2[2D]), BMB2 (see 09_CONNECTOR[5A], DRIVER_2[2A]), BMB2 (see 09_CONNECTOR[5A], DRIVER_2[5D]), CA_1 (see DRIVER_2[3A]), CA_1 (see DRIVER_2[7A]), CA_2 (see DRIVER_2[3B]), CA_2 (see DRIVER_2[7B]), CB1 (see DRIVER_2[2B]), CB1 (see DRIVER_2[2D]), CB2 (see DRIVER_2[2A]), CB2 (see DRIVER_2[5C]), CHUCK_DIAG0, CHUCK_DIAG1, CHUCK_ENN, CS_CHUCK, HA_1 (see DRIVER_2[3A]), HA_1 (see DRIVER_2[6A]), HA_2 (see DRIVER_2[3B]), HA_2 (see DRIVER_2[6B]), HB1, HB2, HB_1, HB_2, LA1 (see DRIVER_2[3A]), LA1 (see DRIVER_2[6B]), LA2 (see DRIVER_2[3A]), LA2 (see DRIVER_2[6C]), LB1 (see DRIVER_2[1D]), LB1 (see DRIVER_2[2A]), LB2 (see DRIVER_2[2A]), LB2 (see DRIVER_2[3D]), SPI_MISO, SPI_MOSI, SPI_SCK, SRA (see DRIVER_2[7B]), SRA (see DRIVER_2[7C]), SRAH, SRAL, SRB (see DRIVER_2[2D]), SRB (see DRIVER_2[5D]), SRBH, SRBL

### Nets
+3V3: C67.2 IC1.20(VCC_IO) IC1.22(SPI_MODE)
GND: C61.1 C62.1 C63.1 C64.1 C65.1 C67.1 IC1.6(GNDA) IC1.11(TST_MODE) IC1.12(CLK) IC1.17(REFL_STEP) IC1.18(REFR_DIR) IC1.21(SD_MODE) IC1.23(ENCB_DCEN_CFG4) IC1.24(ENCA_DCIN_CFG5) IC1.25(ENCN_DCO_CFG6) IC1.30(GNDD_2) IC1.49(EP)
29_VCC: C64.2 IC1.29(VCC) R51.2
VSA: C65.2 IC1.4(VSA) R52.1
NetC59_1: C59.1 IC1.40(BMA1) Q5.S Q6.D ; port BMA1
NetC59_2: C59.2 IC1.42(CA1) ; port CA_1
NetC60_1: C60.1 IC1.32(CPI)
NetC60_2: C60.2 IC1.31(CPO)
NetC61_2: C61.2 IC1.33(VS) Q5.D Q7.D Q9.D Q10.D R52.2 ; port +24V_MOT
NetC62_2: C62.2 IC1.3(12VOUT)
NetC63_2: C63.2 IC1.5(5VOUT) R51.1
NetC66_1: C66.1 IC1.37(BMA2) Q7.S Q8.D ; port BMA2
NetC66_2: C66.2 IC1.35(CA2) ; port CA_2
NetC68_1: C68.1 IC1.45(BMB2) Q9.S Q11.D ; port BMB2
NetC68_2: C68.2 IC1.43(CB2) ; port CB2
NetC69_1: C69.1 IC1.48(BMB1) Q10.S Q12.D ; port BMB1
NetC69_2: C69.2 IC1.2(CB1) ; port CB1
NetIC1_1: IC1.1(HB1) ; port HB1
NetIC1_7: IC1.7(SRAL) ; port SRAL
NetIC1_8: IC1.8(SRAH) ; port SRAH
NetIC1_9: IC1.9(SRBH) ; port SRBH
NetIC1_10: IC1.10(SRBL) ; port SRBL
NetIC1_13: IC1.13(CSN_CFG3) ; port CS_CHUCK
NetIC1_14: IC1.14(SCK_CFG2) ; port SPI_SCK
NetIC1_15: IC1.15(SDI_CFG1) ; port SPI_MOSI
NetIC1_16: IC1.16(SDO_CFG0) ; port SPI_MISO
NetIC1_26: IC1.26(DIAG0_SWN) ; port CHUCK_DIAG0
NetIC1_27: IC1.27(DIAG1_SWP) ; port CHUCK_DIAG1
NetIC1_28: IC1.28(DRV_ENN) ; port CHUCK_ENN
NetIC1_36: IC1.36(HA2) R53.1 ; port HA_2
NetIC1_38: IC1.38(LA2) R54.1 ; port LA2
NetIC1_39: IC1.39(LA1) R50.1 ; port LA1
NetIC1_41: IC1.41(HA1) R49.1 ; port HA_1
NetIC1_44: IC1.44(HB2) ; port HB2
NetIC1_46: IC1.46(LB2) R57.1 ; port LB2
NetIC1_47: IC1.47(LB1) R58.1 ; port LB1
NetQ5_G: Q5.G R49.2
NetQ6_G: Q6.G R50.2
NetQ6_S: Q6.S Q8.S ; port SRA
NetQ7_G: Q7.G R53.2
NetQ8_G: Q8.G R54.2
NetQ9_G: Q9.G R55.2
NetQ10_G: Q10.G R56.2
NetQ11_G: Q11.G R57.2
NetQ11_S: Q11.S Q12.S ; port SRB
NetQ12_G: Q12.G R58.2
NetR55_1: R55.1 ; port HB_2
NetR56_1: R56.1 ; port HB_1

Not connected (* = marked no-connect by the designer): IC1 19(GNDD_1) 34(VCP)

### Library data of the parts
C59 C61 C65-C69 = C0201-100n: as C35 on sheet 06_DRIVER; Part Number: C0201-100n; Manufacturer Part Number: N.A.; ComponentLink1URL: N.A.; ComponentLink1Description: Datasheet; ComponentLink2URL: N.A.; ComponentLink2Description: Supplier link; HelpURL: N.A.; Footprint Doc: 0201; LatestRevisionDate: 2017-11-09; Published: 2014-11-13; Value: 100nF; Supplier 1: N.A.; Supplier Part Number 1: N.A.; Supplier 2: N.A.; Supplier Part Number 2: N.A.; Artikkelnr Noca: N.A.; PartId: 100200078; Component Class: Capacitors; Author: rsk
C60 = C0201-22n-10V-X5R-GRM033R61A223KE84_1: Capacitor, Ceramic, 22nF 10V X5R 0201,±10%; Manufacturer: Murata; Manufacturer Part Number: GRM033R61A223KE84D; Part number NEMS: 100200495; Pad Count: 2; Artikkelnr Noca: N.A.; Component Status: Active; Part Number: C0201-22n-10V-X5R-GRM033R61A223KE84; Component Class: Capacitors; Author: prbu; ComponentLink1URL: https://www.murata.com/en-sg/products/productdetail?partno=GRM033R61A223KE84%23; ComponentLink1Description: Datasheet; ComponentLink2URL: https://www.mouser.com/ProductDetail/Murata-Electronics/GRM033R61A223KE84E?qs=BZBei1rCqCCPqziwOnRusw%3D%3D; ComponentLink2Description: Supplier link; HelpURL: N.A.; Footprint Doc: 0201; LatestRevisionDate: 2021-12-09; Published: 2021-12-09; Value: 22nF; Note: 10V; Supplier 1: Mouser; Supplier Part Number 1: 81-GRM033R61A223KE4E; Supplier 2: Digi-Key; Supplier Part Number 2: 490-13334-1-ND; Part number IPS: N.A.; Part number Norautron: N.A.; PartId: 100200495
C62 C63 = CAP0805_4.7UF_50V: 4.7 µF ±10% 50V Ceramic Capacitor X5R 0805 (2012 Metric); Manufacturer Part Number: GRT21BR61H475KE13L; Order Code: DIGI: 490-12394-2-ND
C64 = CAP0402_470NF_10V: 0.47 µF ±10% 10V Ceramic Capacitor X5R 0402 (1005 Metric); Manufacturer Part Number: CL05A474KP5NNNC; Order Code: DIGI: 1276-1173-2-ND; Sirius Stock Code: *; LCSC Part Number: C47339; LCSC Manufacturer Part Number: CL05A474KP5NNNC
IC1 = TMC5160-TA: Integrated Circuit; Manufacturer_Name: Analog Devices; Datasheet Link: https://datasheet.datasheetarchive.com/originals/distributors/DKDS-40/47761.pdf; Height: 1.2mm; Manufacturer_Part_Number: TMC5160-TA; Mouser Part Number: N/A; Mouser Price/Stock: https://www.mouser.co.uk/ProductDetail/ADI-Trinamic/TMC5160-TA?qs=TiOZkKH1s2S%2FryBy%252BZXLdA%3D%3D
Q5-Q12 = BSC072N08NS5: Transistor; Manufacturer_Name: Infineon; Datasheet Link: https://www.infineon.com/dgdl/Infineon-BSC072N08NS5-DS-v02_00-EN.pdf?fileId=5546d4624ad04ef9014ae3d8e8192c7c; Manufacturer_Part_Number: BSC072N08NS5; Mouser Part Number: N/A; Mouser Price/Stock: https://www.mouser.co.uk/ProductDetail/Infineon-Technologies/BSC072N08NS5?qs=eERmAtE5kX0PueJFVqKhsA%3D%3D
R49 R50 R53-R58 = RNCF0603AKT10R0: Resistor; Manufacturer_Name: Stackpole Electronics; Datasheet Link: https://cs.seielect.com/catalog/SEI-RNCF.pdf; Height: 0.55mm; Manufacturer_Part_Number: RNCF0603AKT10R0; Mouser Part Number: 708-RNCF0603AKT10R0; Mouser Price/Stock: https://www.mouser.co.uk/ProductDetail/SEI-Stackpole/RNCF0603AKT10R0?qs=IPgv5n7u5QaEV3NAu4qPaA%3D%3D; Arrow Part Number: RNCF0603AKT10R0; Arrow Price/Stock: https://www.arrow.com/en/products/rncf0603akt10r0/stackpole-electronics?region=nac
R51 = Res1_7: RES 2.2K OHM 1% 1/16W 0402; Manufacturer Part Number: RC0402FR-072K2L; Manufacturer: Yageo; Value: 2.2K; Supplier Part Number: 311-2.20KLRCT-ND
R52 = Res1: RES 0 OHM JUMPER 1/16W 0402; Manufacturer Part Number: RC0402FR-070RL; Manufacturer: Yageo; Value: 0R; Supplier Part Number: 311-0.0LRCT-ND

## Sheet 09_CONNECTOR.SchDoc: HW_ADHERENT_SYSCTRL_R1
size A3; SheetNumber: 12; SheetTotal: 14
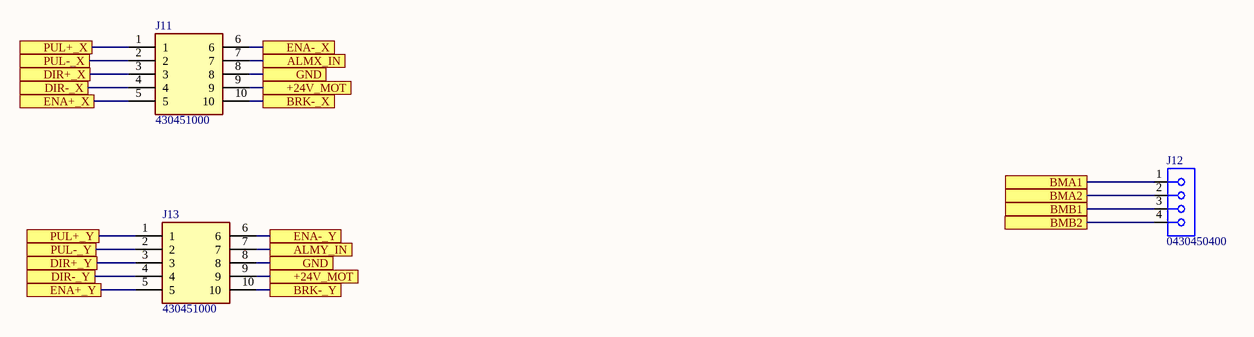
[diagram p8: 09_CONNECTOR.SchDoc]

### Parts
J11  430451000  [430451010]
J12  0430450400  [CONN_SD-43045-001_04_MOL]
J13  430451000  [430451010]

### Ports
+24V_MOT (see 06_DRIVER[5B], 06_DRIVER[5D], 09_CONNECTOR[2A], DRIVER_2[2C], DRIVER_2[5B], DRIVER_2[5C], DRIVER_2[7A], DRIVER_2[7B]), +24V_MOT (see 06_DRIVER[5B], 06_DRIVER[5D], 09_CONNECTOR[2B], DRIVER_2[2C], DRIVER_2[5B], DRIVER_2[5C], DRIVER_2[7A], DRIVER_2[7B]), ALMX_IN (see 06_DRIVER[6B]), ALMY_IN, BMA1 (see DRIVER_2[3A], DRIVER_2[7A]), BMA2 (see DRIVER_2[3A], DRIVER_2[7B]), BMB1 (see DRIVER_2[2A], DRIVER_2[2D]), BMB2 (see DRIVER_2[2A], DRIVER_2[5D]), BRK-_X, BRK-_Y (see 06_DRIVER[5C]), DIR+_X, DIR+_Y, DIR-_X, DIR-_Y, ENA+_X, ENA+_Y, ENA-_X, ENA-_Y, GND (see 09_CONNECTOR[2A]), GND (see 09_CONNECTOR[2B]), PUL+_X, PUL+_Y, PUL-_X, PUL-_Y

### Nets
NetC59_1: J12.1 ; port BMA1
NetC61_2: J11.9 J13.9 ; port +24V_MOT
NetC66_1: J12.2 ; port BMA2
NetC68_1: J12.4 ; port BMB2
NetC69_1: J12.3 ; port BMB1
NetD2_2: J13.10 ; port BRK-_Y
NetJ11_1: J11.1 ; port PUL+_X
NetJ11_2: J11.2 ; port PUL-_X
NetJ11_3: J11.3 ; port DIR+_X
NetJ11_4: J11.4 ; port DIR-_X
NetJ11_5: J11.5 ; port ENA+_X
NetJ11_6: J11.6 ; port ENA-_X
NetJ11_7: J11.7 ; port ALMX_IN
NetJ11_8: J11.8 J13.8 ; port GND
NetJ11_10: J11.10 ; port BRK-_X
NetJ13_1: J13.1 ; port PUL+_Y
NetJ13_2: J13.2 ; port PUL-_Y
NetJ13_3: J13.3 ; port DIR+_Y
NetJ13_4: J13.4 ; port DIR-_Y
NetJ13_5: J13.5 ; port ENA+_Y
NetJ13_6: J13.6 ; port ENA-_Y
NetJ13_7: J13.7 ; port ALMY_IN

### Library data of the parts
J11 J13 = 430451000: Connector; Manufacturer_Name: Molex; Datasheet Link: https://www.molex.com/pdm_docs/sd/430450200_sd.pdf; Height: 8.77mm; Manufacturer_Part_Number: 430451000
J12 = 0430450400: Connector Header Through Hole, Right Angle 4 position 0.118" (3.00mm); Manifacturer: MOLEX; Supplier: Digi; WM1814-ND

## Sheet DRIVER_3.SchDoc: HW_ADHERENT_SYSCTRL_R1
size A3; SheetNumber: 13; SheetTotal: 14
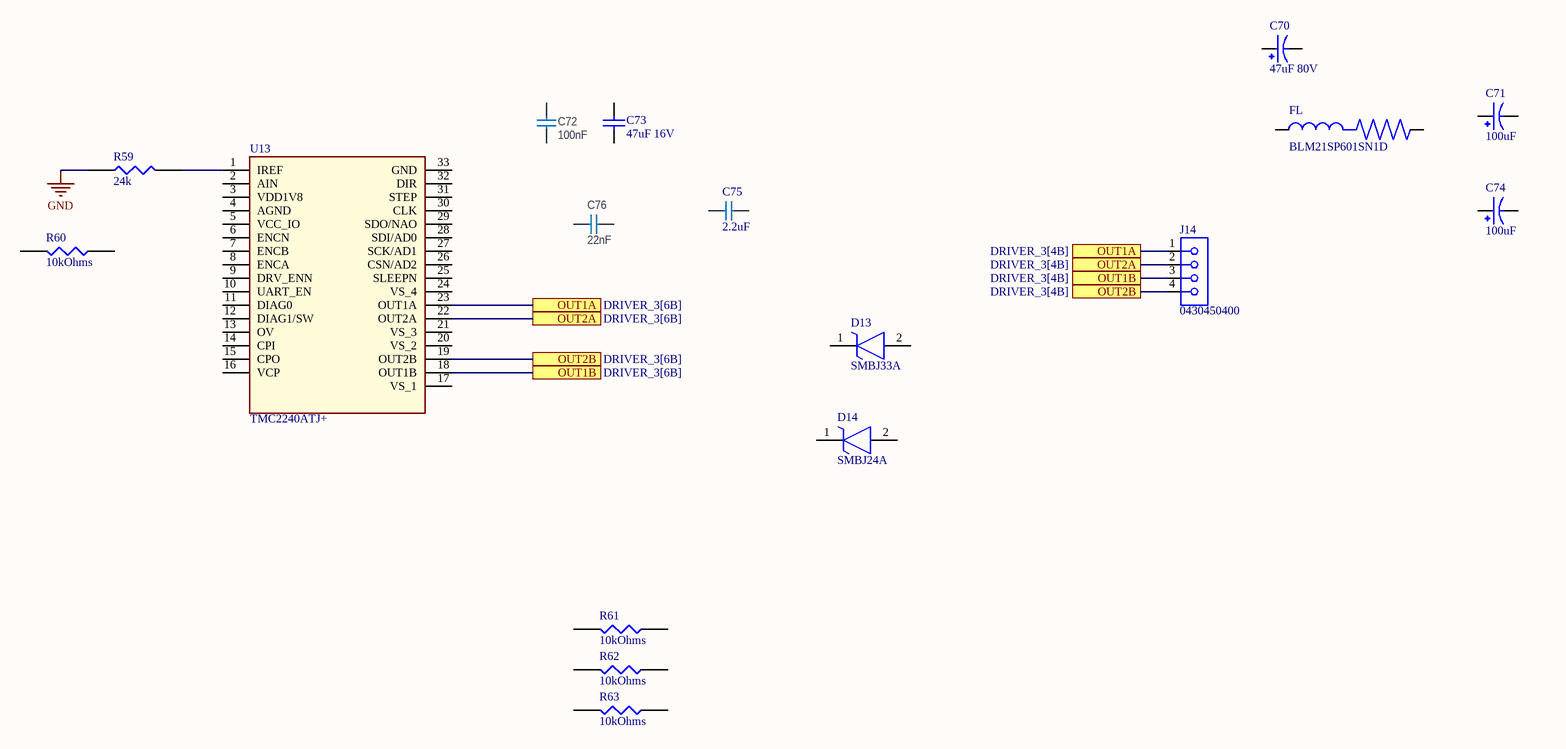
[diagram p9: DRIVER_3.SchDoc]

### Parts
C70  47uF 80V  [CAP_EEEFK1K470P]
C71  100uF  [CAP_EEEFK1J101P]
C72  100nF  [CAPC0603X03L_C]
C73  value 47uF 16V  [CAP1210]  (hidden comment: CAP CER 47UF 16V X5R 1210)
C74  100uF  [CAP_EEEFK1J101P]
C75  2.2uF  [CAPC1608X100N]
C76  22nF  [CAPC0603X03L_C]
D13  SMBJ33A  [SMBJ12A]
D14  SMBJ24A  [SMBJ12A]
FL  BLM21SP601SN1D  [BEADC2012X105N]
J14  0430450400  [CONN_SD-43045-001_04_MOL]
R59  24k  [0603]
R60  10kOhms  [RESC0603X03L_C]
R61  10kOhms  [RESC0603X03L_C]
R62  10kOhms  [RESC0603X03L_C]
R63  10kOhms  [RESC0603X03L_C]
U13  TMC2240ATJ+  [QFN50P500X500X80-33N]

### Ports
OUT1A (see DRIVER_3[4B]), OUT1A (see DRIVER_3[6B]), OUT1B (see DRIVER_3[4B]), OUT1B (see DRIVER_3[6B]), OUT2A (see DRIVER_3[4B]), OUT2A (see DRIVER_3[6B]), OUT2B (see DRIVER_3[4B]), OUT2B (see DRIVER_3[6B])

### Nets
GND: R59.1
NetJ14_1: J14.1 U13.23(OUT1A) ; port OUT1A
NetJ14_2: J14.2 U13.22(OUT2A) ; port OUT2A
NetJ14_3: J14.3 U13.18(OUT1B) ; port OUT1B
NetJ14_4: J14.4 U13.19(OUT2B) ; port OUT2B
NetR59_2: R59.2 U13.1(IREF)

Not connected (* = marked no-connect by the designer): C70 1 2; C71 1 2; C72 1 2; C73 1 2; C74 1 2; C75 1 2; C76 1 2; D13 1(K) 2(A); D14 1(K) 2(A); FL 1 2; R60 1 2; R61 1 2; R62 1 2; R63 1 2; U13 2(AIN) 3(VDD1V8) 4(AGND) 5(VCC_IO) 6(ENCN) 7(ENCB) 8(ENCA) 9(DRV_ENN) 10(UART_EN) 11(DIAG0) 12(DIAG1/SW) 13(OV) 14(CPI) 15(CPO) 16(VCP) 17(VS_1) 20(VS_2) 21(VS_3) 24(VS_4) 25(SLEEPN) 26(CSN/AD2) 27(SCK/AD1) 28(SDI/AD0) 29(SDO/NAO) 30(CLK) 31(STEP) 32(DIR) 33(GND)

### Library data of the parts
C70 = EEE-FK1K470P: 47 µF 80 V Aluminum Electrolytic Capacitors Radial, Can - SMD 2000 Hrs @ 105°C; Manufacturer: Panasonic Industry; Supplier: Digi; PCE3831DKR-ND
C71 C74 = EEE-FK1J101P: 100 µF 63 V Aluminum Electrolytic Capacitors Radial, Can - SMD 2000 Hrs @ 105°C; Manufacturer: Panasonic Industry; Supplier: Digi; PCE3819DKR-ND
C72 = C0201-100n-25V-X5R: Capacitor, Ceramic, X5R, ±10%, 25V; Manufacturer: Murata; Manufacturer Part Number: GRM033R61E104KE14J; Part number NEMS: 100200459; Artikkelnr Noca: N.A.; Pad Count: 2; Component Status: Active; Part Number: C0201-100n-25V-X5R; LatestRevisionDate: 2020-12-16; Published: 2020-12-16; Value: 100nF; Note: 25V; Footprint Doc: 0201; Part number IPS: N.A.; ComponentLink1URL: https://search.murata.co.jp/Ceramy/image/img/A01X/G101/ENG/GRM033R61E104KE14-01.pdf; ComponentLink1Description: Datasheet; ComponentLink2URL: https://www.murata.com/en-global/products/productdetail?partno=GRM033R61E104KE14%23; ComponentLink2Description: Supplier link; HelpURL: N.A.; Supplier 1: Digi-Key; Supplier Part Number 1: 490-14571-1-ND; Supplier 2: Mouser; Supplier Part Number 2: 81-GRM033R61E104KE4J; Component Class: Capacitors; PartId: 100200459; Author: rsk; Part number Norautron: N.A.
C73 = CAP1210_47UF_16V: 16V 47uF X5R ±10% 1210 Multilayer Ceramic Capacitors MLCC - SMD/SMT ROHS; Manufacturer Part Number: CS3225X5R476K160NRL; Order Code: LCSC: C2918513; LCSC Manufacturer Part Number: CS3225X5R476K160NRL; LCSC Part Number: C2918513
C75 = 0603X225K250CT: 2.2 µF ±10% 25V Ceramic Capacitor X5R 0603 (1608 Metric); Manufacturer: Walsin Technology Corporation; Supplier: Digi; 1292-0603X225K250CTDKR-ND; JLCPCB PART#: C237194
C76 = C0201-22n-10V-X5R-GRM033R61A223KE84_1: as C60 on sheet DRIVER_2; Part Number: C0201-22n-10V-X5R-GRM033R61A223KE84; Component Class: Capacitors; Author: prbu; ComponentLink1URL: https://www.murata.com/en-sg/products/productdetail?partno=GRM033R61A223KE84%23; ComponentLink1Description: Datasheet; ComponentLink2URL: https://www.mouser.com/ProductDetail/Murata-Electronics/GRM033R61A223KE84E?qs=BZBei1rCqCCPqziwOnRusw%3D%3D; ComponentLink2Description: Supplier link; HelpURL: N.A.; Footprint Doc: 0201; LatestRevisionDate: 2021-12-09; Published: 2021-12-09; Value: 22nF; Note: 10V; Supplier 1: Mouser; Supplier Part Number 1: 81-GRM033R61A223KE4E; Supplier 2: Digi-Key; Supplier Part Number 2: 490-13334-1-ND; Part number IPS: N.A.; Part number Norautron: N.A.; PartId: 100200495
D13 = SMBJ33A: TVS Diode (Uni-directional); Manufacturer_Name: STMicroelectronics; Datasheet Link: https://www.st.com/resource/en/datasheet/smbj12a.pdf; Height: 2.45mm; Manufacturer_Part_Number: SMBJ33A
D14 = SMBJ24A: TVS Diode (Uni-directional); Manufacturer_Name: STMicroelectronics; Datasheet Link: https://www.st.com/resource/en/datasheet/smbj12a.pdf; Height: 2.45mm; Manufacturer_Part_Number: SMBJ24A
FL = BLM21SP601SN1D: 600 Ohms @ 100MHz 1 Power Line Ferrite Bead 0805 _2012 Metric_ 2.3A; MF: Murata Electronics North America; MP: BLM21SP601SN1D; Availability: Unavailable; SnapEDA_Link: https://www.snapeda.com/parts/BLM21SP601SN1D/Murata/view-part/3660838/?ref=snap; Package: 2012 Murata; Value: *; Price: None
J14 = 0430450400: as J12 on sheet 09_CONNECTOR; Supplier: Digi; WM1814-ND
R59 = RMCF0603FT24K0: 24 kOhms ±1% 0.1W, 1/10W Chip Resistor 0603 (1608 Metric) Automotive AEC-Q200 Thick Film; Manufacturer: Stackpole Electronics Inc; Supplier: Digi; RMCF0603FT24K0DKR-ND
R60-R63 = TNPW060310K0FHTA: as R24 on sheet 06_DRIVER; Supplier: Digi; 541-3906-6-ND
U13 = TMC2240ATJ+: Bipolar Motor Driver Power MOSFET SPI, Step/Direction, UART 32-TQFN (5x5); Manufacturer: Analog Devices Inc./Maxim Integrated; Supplier: Digi; 505-TMC2240ATJ+-ND

## Sheet DRIVER4.SchDoc: HW_ADHERENT_SYSCTRL_R1
size A; SheetNumber: 14; SheetTotal: 14
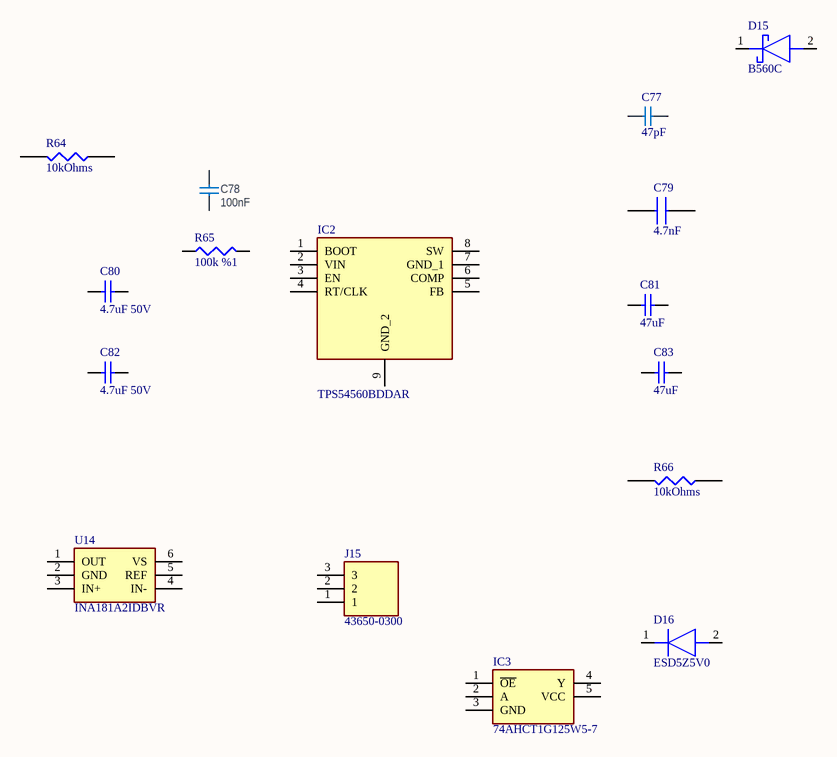
[diagram p10: DRIVER4.SchDoc]

### Parts
C77  47pF  [CAPC1608X100N]
C78  100nF  [CAPC0603X03L_C]
C79  4.7nF  [CAP0805]
C80  value 4.7uF 50V  [SMC0805]  (hidden comment: CAP CER 4.7UF 50V X5R 0805)
C81  47uF  [0805_C]
C82  value 4.7uF 50V  [SMC0805]  (hidden comment: CAP CER 4.7UF 50V X5R 0805)
C83  47uF  [0805_C]
D15  B560C  [DIOM7959X250N]
D16  ESD5Z5V0  [SODFL1608X70N]
IC2  TPS54560BDDAR  [SOIC127P600X170-9N]
IC3  74AHCT1G125W5-7  [SOT95P285X140-5N]
J15  43650-0300  [436500300]
R64  10kOhms  [RESC0603X03L_C]
R65  100k %1  [RESIS_0603]
R66  10kOhms  [RESC0603X03L_C]
U14  INA181A2IDBVR  [SOT95P280X145-6N]

### Nets

Not connected (* = marked no-connect by the designer): C77 1 2; C78 1 2; C79 1 2; C80 1 2; C81 1 2; C82 1 2; C83 1 2; D15 1(K) 2(A); D16 1(K) 2(A); IC2 1(BOOT) 2(VIN) 3(EN) 4(RT/CLK) 5(FB) 6(COMP) 7(GND_1) 8(SW) 9(GND_2); IC3 1(~{OE}) 2(A) 3(GND) 4(Y) 5(VCC); J15 1 2 3; R64 1 2; R65 1 2; R66 1 2; U14 1(OUT) 2(GND) 3(IN+) 4(IN-) 5(REF) 6(VS)

### Library data of the parts
C77 = GMC10CG470F200NT: 47 pF ±1% 200V Ceramic Capacitor C0G, NP0 0603 (1608 Metric); Manufacturer: Cal-Chip Electronics, Inc.; MPN: GMC10CG470F200NT; Supplier: 4713-GMC10CG470F200NTDKR-ND
C78 = C0201-100n-25V-X5R: as C72 on sheet DRIVER_3; Part Number: C0201-100n-25V-X5R; LatestRevisionDate: 2020-12-16; Published: 2020-12-16; Value: 100nF; Note: 25V; Footprint Doc: 0201; Part number IPS: N.A.; ComponentLink1URL: https://search.murata.co.jp/Ceramy/image/img/A01X/G101/ENG/GRM033R61E104KE14-01.pdf; ComponentLink1Description: Datasheet; ComponentLink2URL: https://www.murata.com/en-global/products/productdetail?partno=GRM033R61E104KE14%23; ComponentLink2Description: Supplier link; HelpURL: N.A.; Supplier 1: Digi-Key; Supplier Part Number 1: 490-14571-1-ND; Supplier 2: Mouser; Supplier Part Number 2: 81-GRM033R61E104KE4J; Component Class: Capacitors; PartId: 100200459; Author: rsk; Part number Norautron: N.A.
C79 = CAP0805_4.7nF_1kV: 4700 pF ±10% 1000V (1kV) Ceramic Capacitor X7R 0805 (2012 Metric); Manufacturer_Name: Samsung Electro-Mechanics; Manufacturer Part Number: C0805C472KDRAC7800; Value: 4.7nF 1kV; Datasheet Link: https://www.yageo.com/upload/media/product/productsearch/datasheet/mlcc/UPY-GPHC_X5R_4V-to-50V_27.pdf; Height: 1.45mm; Mouser Price/Stock: https://www.mouser.co.uk/ProductDetail/YAGEO/CC0805KKX5R8BB106?qs=57cj7OiSijm89pM64t1AGQ%3D%3D
C80 C82 = CAP0805_4.7UF_50V: as C62 on sheet DRIVER_2
C81 C83 = Cap_1_3: CAP CER 47UF 10V X5R 0805; Manufacturer: Murata Electronics North America; Manufacturer Part Number: GRM21BR61A476ME15K; Value: 47uF; Supplier Part Number: 490-GRM21BR61A476ME15KCT-ND
D15 = B560C: Schottky Diode; Manufacturer_Name: Lite-On; Datasheet Link: https://datasheet.datasheetarchive.com/originals/distributors/Datasheets-17/DSA-323419.pdf; Height: 2.5mm; Manufacturer_Part_Number: B560C; Arrow Part Number: B560C; Arrow Price/Stock: https://www.arrow.com/en/products/b560c/lite-on-technology.html?utm_currency=USD&region=nac
D16 = ESD5Z5V0: Diode; Manufacturer_Name: Diotec; Datasheet Link: https://www.mouser.in/datasheet/2/849/esd5z2v5-2891948.pdf; Height: 0.7mm; Manufacturer_Part_Number: ESD5Z5V0; Mouser Part Number: 637-ESD5Z5V0; Mouser Price/Stock: https://www.mouser.co.uk/ProductDetail/Diotec-Semiconductor/ESD5Z5V0?qs=OlC7AqGiEDkOteFEVl3upQ%3D%3D; Arrow Part Number: ESD5Z5V0; Arrow Price/Stock: https://www.arrow.com/en/products/esd5z5v0/diotec-semiconductor-ag?utm_currency=USD&region=nac
IC2 = TPS54560BDDAR: Integrated Circuit; Manufacturer_Name: Texas Instruments; Datasheet Link: http://www.ti.com/lit/gpn/TPS54560B; Height: 1.7mm; Manufacturer_Part_Number: TPS54560BDDAR; Mouser Part Number: 595-TPS54560BDDAR; Mouser Price/Stock: https://www.mouser.co.uk/ProductDetail/Texas-Instruments/TPS54560BDDAR?qs=gZXFycFWdAMPyxqrm5VZeg%3D%3D; Arrow Part Number: TPS54560BDDAR; Arrow Price/Stock: https://www.arrow.com/en/products/tps54560bddar/texas-instruments.html?utm_currency=USD&region=nac
IC3 = 74AHCT1G125W5-7: Integrated Circuit; Manufacturer_Name: Diodes Incorporated; Datasheet Link: https://www.diodes.com//assets/Datasheets/74AHCT1G125.pdf; Height: 1.4mm; Manufacturer_Part_Number: 74AHCT1G125W5-7; Mouser Part Number: 621-74AHCT1G125W5-7; Mouser Price/Stock: https://www.mouser.co.uk/ProductDetail/Diodes-Incorporated/74AHCT1G125W5-7?qs=MKoP7Oyr0W7vMAMo33ehAw%3D%3D; Arrow Part Number: 74AHCT1G125W5-7; Arrow Price/Stock: https://www.arrow.com/en/products/74ahct1g125w5-7/diodes-incorporated.html?utm_currency=USD&region=nac
J15 = 43650-0300: Connector; Manufacturer_Name: Molex; Datasheet Link: https://www.molex.com/pdm_docs/sd/436500200_sd.pdf; Height: 13.56mm; Manufacturer_Part_Number: 43650-0300; Mouser Part Number: 538-43650-0300; Mouser Price/Stock: https://www.mouser.co.uk/ProductDetail/Molex/43650-0300?qs=P7cO%252B%252BFDLzTpuYfoYulxAA%3D%3D; Arrow Part Number: 43650-0300; Arrow Price/Stock: https://www.arrow.com/en/products/43650-0300/molex?region=nac
R64 R66 = TNPW060310K0FHTA: as R24 on sheet 06_DRIVER; Supplier: Digi; 541-3906-6-ND
R65 = 0603WAF1003T5E: -55℃~+155℃ 100kΩ 100mW 75V Thick Film Resistor ±1% ±100ppm/℃ 0603 Chip Resistor - Surface Mount ROHS; Manufacturer: UNI-ROYAL(Uniroyal Elec); Supplier_JLCPCB: C25803; Supplier_MOUSER: 303-0603WAF1003T5E
U14 = INA181A2IDBVR: Undefined or Miscellaneous; Manufacturer_Name: Texas Instruments; Datasheet Link: http://www.ti.com/general/docs/suppproductinfo.tsp?distId=26&gotoUrl=http%3A%2F%2Fwww.ti.com%2Flit%2Fgpn%2Fina181; Height: 1.45mm; Manufacturer_Part_Number: INA181A2IDBVR; Mouser Part Number: 595-INA181A2IDBVR; Mouser Price/Stock: https://www.mouser.co.uk/ProductDetail/Texas-Instruments/INA181A2IDBVR?qs=5aG0NVq1C4wvxWxbAGEmKw%3D%3D; Arrow Part Number: INA181A2IDBVR; Arrow Price/Stock: https://www.arrow.com/en/products/ina181a2idbvr/texas-instruments.html?utm_currency=USD&region=nac

## Nets that join several sheets
+3V3: 05_MCU (13 pins), 06_DRIVER (8 pins), DRIVER_2 (C67.2 IC1.20 IC1.22)
GND: 03_POWER1 (24 pins), 05_MCU (22 pins), 06_DRIVER (12 pins), DRIVER_2 (17 pins), DRIVER_3 (R59.1)
NetC59_1: DRIVER_2 (C59.1 IC1.40 Q5.S Q6.D), 09_CONNECTOR (J12.1)
NetC61_2: 06_DRIVER (D1.1 D2.1), DRIVER_2 (7 pins), 09_CONNECTOR (J11.9 J13.9)
NetC66_1: DRIVER_2 (C66.1 IC1.37 Q7.S Q8.D), 09_CONNECTOR (J12.2)
NetC68_1: DRIVER_2 (C68.1 IC1.45 Q9.S Q11.D), 09_CONNECTOR (J12.4)
NetC69_1: DRIVER_2 (C69.1 IC1.48 Q10.S Q12.D), 09_CONNECTOR (J12.3)
NetD2_2: 06_DRIVER (D2.2 Q2.3), 09_CONNECTOR (J13.10)
NetJ11_7: 06_DRIVER (R25.1 R26.1), 09_CONNECTOR (J11.7)

## Assembly variants
Variant of HW_ADHERENT_SYSCTRL_R1: all parts fitted